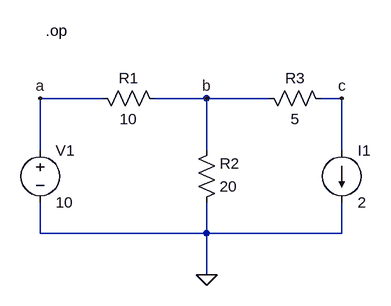
[diagram p0: schematic Circuit_1.asc]
Circuit_1.asc, the LTspice schematic file:
Version 4
SHEET 1 880 680
WIRE 192 32 96 32
WIRE 352 32 272 32
WIRE 448 32 352 32
WIRE 560 32 528 32
WIRE 96 112 96 32
WIRE 352 112 352 32
WIRE 560 112 560 32
WIRE 96 240 96 192
WIRE 352 240 352 192
WIRE 352 240 96 240
WIRE 560 240 560 192
WIRE 560 240 352 240
WIRE 352 304 352 240
FLAG 352 304 0
FLAG 96 32 a
FLAG 352 32 b
FLAG 560 32 c
SYMBOL voltage 96 96 R0
SYMATTR InstName V1
SYMATTR Value 10
SYMBOL current 560 112 R0
SYMATTR InstName I1
SYMATTR Value 2
SYMBOL res 176 16 M90
WINDOW 0 0 56 VBottom 2
WINDOW 3 32 56 VTop 2
SYMATTR InstName R1
SYMATTR Value 10
SYMBOL res 336 208 M180
WINDOW 0 36 76 Left 2
WINDOW 3 36 40 Left 2
SYMATTR InstName R2
SYMATTR Value 20
SYMBOL res 432 16 M90
WINDOW 0 0 56 VBottom 2
WINDOW 3 32 56 VTop 2
SYMATTR InstName R3
SYMATTR Value 5
TEXT 104 -72 Left 2 !.op

The netlist it stands for:
* Circuit_1.asc
V1 a 0 10
I1 c 0 2
R1 a b 10
R2 0 b 20
R3 b c 5
.op
.backanno
.end